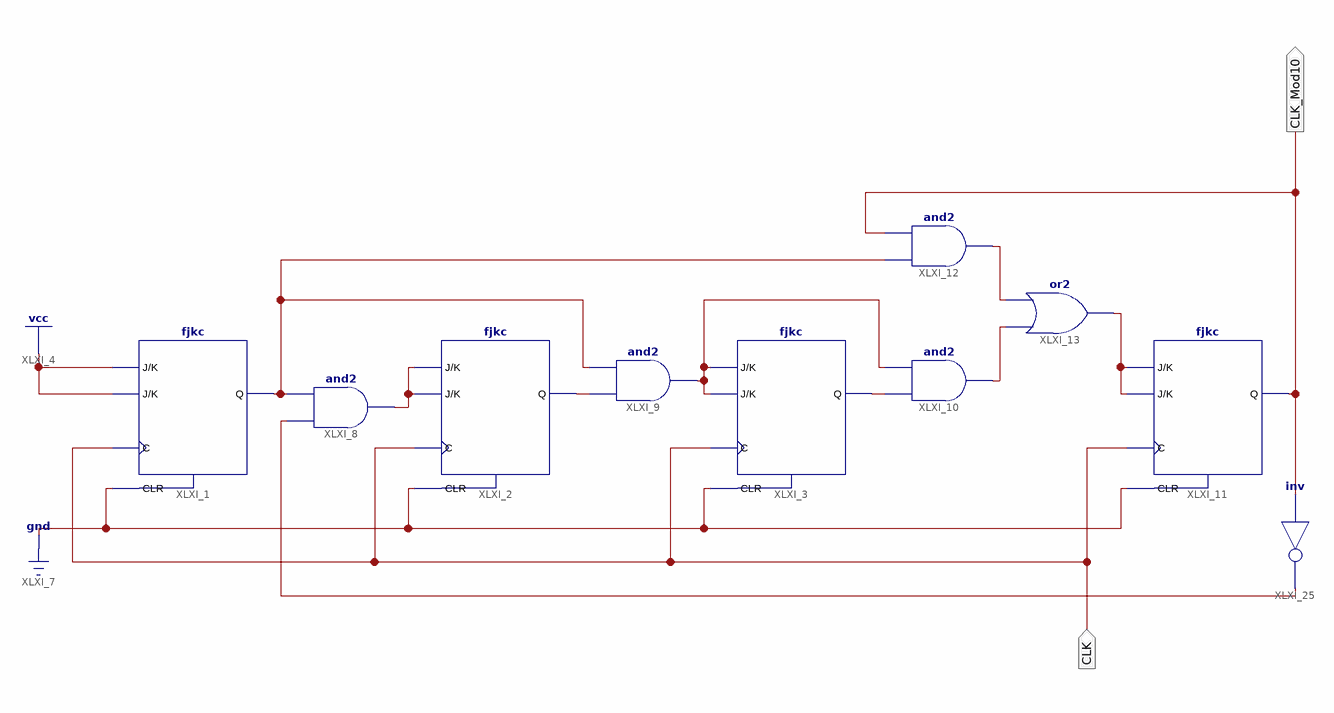
[diagram p0: schematic sheet 1]
// Xilinx ISE schematic Mod10.sch (spartan6) as structural Verilog: 10 symbols, 2 ports
module Mod10 (
  input  CLK,
  output CLK_Mod10
);

  wire XLXN_7, XLXN_13, XLXN_19, XLXN_21, XLXN_22, XLXN_25, XLXN_26, XLXN_32, XLXN_68;

  fjkc XLXI_2 (.C(CLK), .CLR(1'b0), .J(XLXN_7), .K(XLXN_7), .Q(XLXN_13));
  and XLXI_8 (XLXN_7, XLXN_68, XLXN_22);
  and XLXI_9 (XLXN_21, XLXN_13, XLXN_22);
  fjkc XLXI_1 (.C(CLK), .CLR(1'b0), .J(1'b1), .K(1'b1), .Q(XLXN_22));
  and XLXI_10 (XLXN_25, XLXN_19, XLXN_21);
  fjkc XLXI_3 (.C(CLK), .CLR(1'b0), .J(XLXN_21), .K(XLXN_21), .Q(XLXN_19));
  and XLXI_12 (XLXN_26, XLXN_22, CLK_Mod10);
  or XLXI_13 (XLXN_32, XLXN_25, XLXN_26);
  fjkc XLXI_11 (.C(CLK), .CLR(1'b0), .J(XLXN_32), .K(XLXN_32), .Q(CLK_Mod10));
  not XLXI_25 (XLXN_68, CLK_Mod10);
endmodule
